# EAGLE schematic Remote (EAGLE 7.2.0)
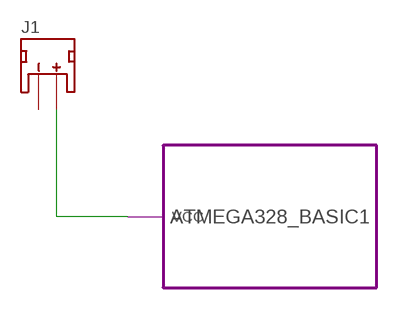
[diagram p0: schematic, sheet 1]

## Parts
J1  JST_2MM_MALE  [JST-2-SMD]

## Module instances
ATMEGA328_BASIC1 = ATMEGA328_BASIC

## Nets
N$1: J1.2(+) ; port ATMEGA328_BASIC1.VCC
Unconnected: J1.1(-) J1.NC1(PAD1) J1.NC2(PAD2)

## Library data of the parts
J1 = SparkFun-Connectors:JST_2MM_MALE: Mates to single-cell LiPo batteries. CONN-08352; PROD_ID: CONN-08352

## Module ATMEGA328_BASIC
Ports: VCC(pwr)
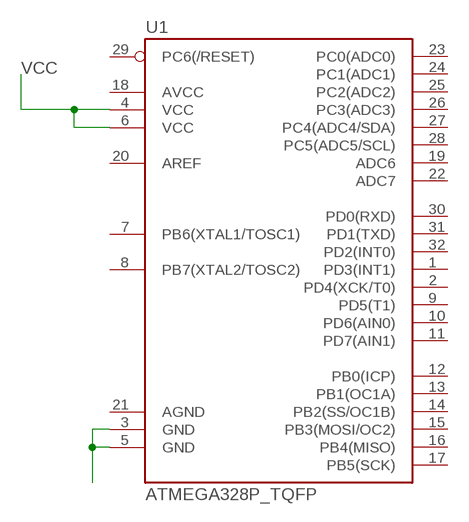
[diagram p1: schematic, module ATMEGA328_BASIC, sheet 1]

### Parts
U1  ATMEGA328P_TQFP  [TQFP32-08]

### Nets
N$1: U1.3(GND) U1.5(GND)
VCC: U1.4(VCC) U1.6(VCC)
Unconnected: U1.1(PD3(INT1)) U1.2(PD4(XCK/T0)) U1.7(PB6(XTAL1/TOSC1)) U1.8(PB7(XTAL2/TOSC2)) U1.9(PD5(T1)) U1.10(PD6(AIN0)) U1.11(PD7(AIN1)) U1.12(PB0(ICP)) U1.13(PB1(OC1A)) U1.14(PB2(SS/OC1B)) U1.15(PB3(MOSI/OC2)) U1.16(PB4(MISO)) U1.17(PB5(SCK)) U1.18(AVCC) U1.19(ADC6) U1.20(AREF) U1.21(AGND) U1.22(ADC7) U1.23(PC0(ADC0)) U1.24(PC1(ADC1)) U1.25(PC2(ADC2)) U1.26(PC3(ADC3)) U1.27(PC4(ADC4/SDA)) U1.28(PC5(ADC5/SCL)) U1.29(PC6(/RESET)) U1.30(PD0(RXD)) U1.31(PD1(TXD)) U1.32(PD2(INT0))

### Library data of the parts
U1 = SparkFun-DigitalIC:ATMEGA328P_TQFP; PROD_ID: IC-09069